# EAGLE design IA-prop (EAGLE 6.1)
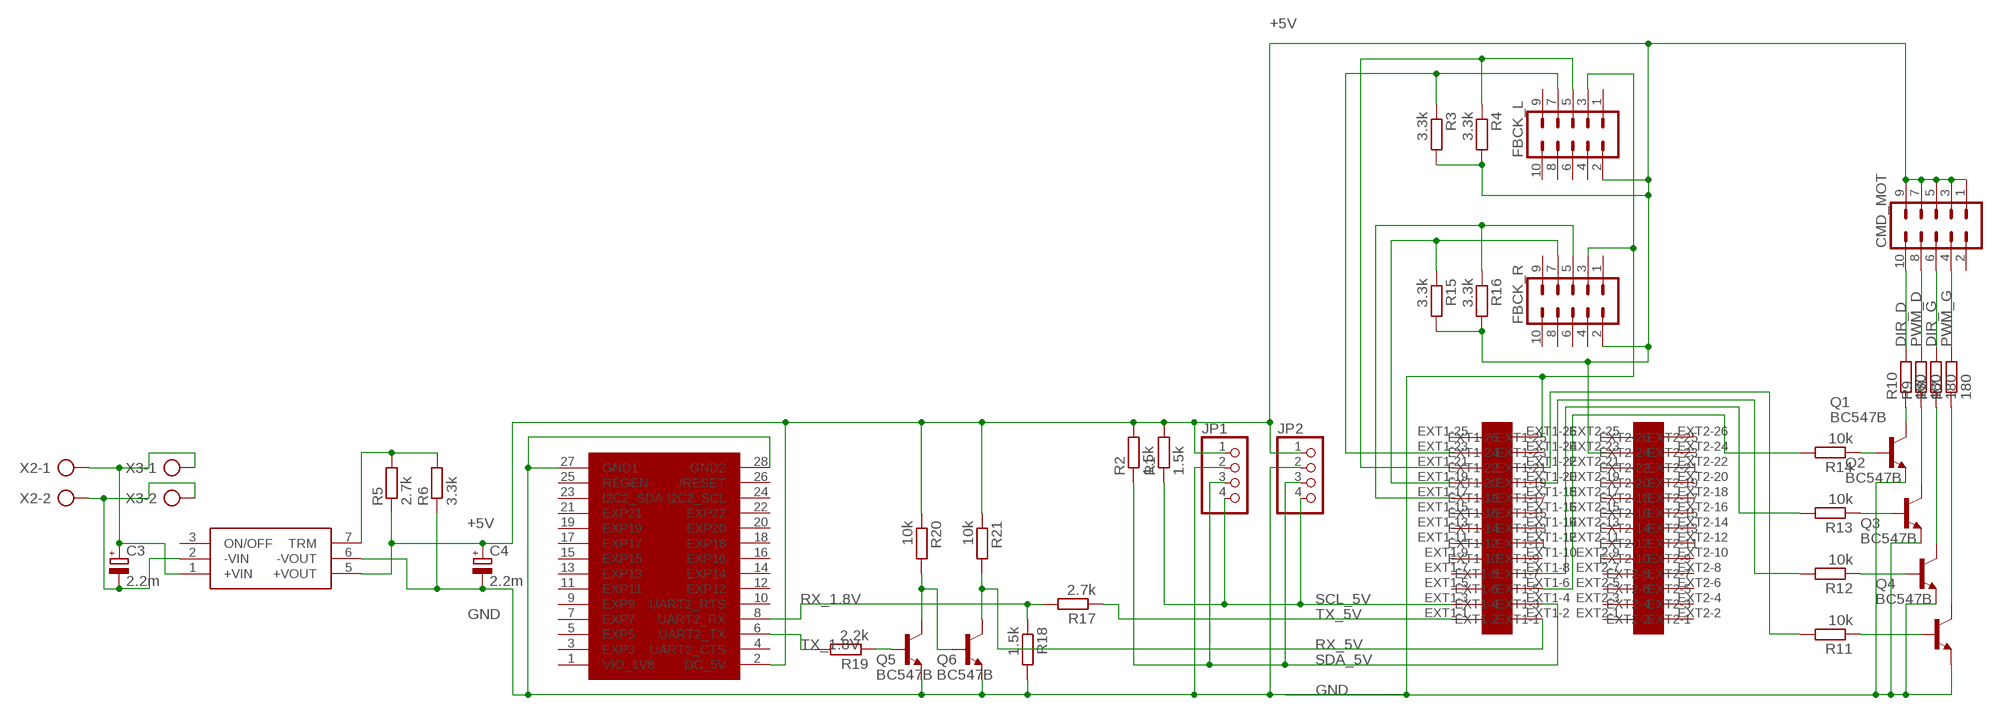
[diagram p0: schematic, sheet 1]

## Parts
BB1  BEAGLEBOARD  [BEAGLEBOARD]
C3  2.2m  CPOL-EUE5-13  [E5-13]
C4  2.2m  CPOL-EUE5-13  [E5-13]
CMD_MOT  MA05-2  [MA05-2]
FBCK_L  MA05-2  [MA05-2]
FBCK_R  MA05-2  [MA05-2]
JP1  PINHD-1X4  [1X04]
JP2  PINHD-1X4  [1X04]
Q1  BC547B  [TO92]
Q2  BC547B  [TO92]
Q3  BC547B  [TO92]
Q4  BC547B  [TO92]
Q5  BC547B  [TO92]
Q6  BC547B  [TO92]
R1  1.5k  R-EU_0207/12  [0207/12]
R2  1.5k  R-EU_0207/7  [0207/7]
R3  3.3k  R-EU_0207/7  [0207/7]
R4  3.3k  R-EU_0207/7  [0207/7]
R5  2.7k  R-EU_0207/7  [0207/7]
R6  3.3k  R-EU_0207/7  [0207/7]
R7  180  R-EU_0207/7  [0207/7]
R8  180  R-EU_0207/7  [0207/7]
R9  180  R-EU_0207/7  [0207/7]
R10  180  R-EU_0207/7  [0207/7]
R11  10k  R-EU_0207/10  [0207/10]
R12  10k  R-EU_0207/10  [0207/10]
R13  10k  R-EU_0207/7  [0207/7]
R14  10k  R-EU_0207/7  [0207/7]
R15  3.3k  R-EU_0207/7  [0207/7]
R16  3.3k  R-EU_0207/7  [0207/7]
R17  2.7k  R-EU_0207/10  [0207/10]
R18  1.5k  R-EU_0207/7  [0207/7]
R19  2.2k  R-EU_0207/7  [0207/7]
R20  10k  R-EU_0207/7  [0207/7]
R21  10k  R-EU_0207/7  [0207/7]
U$1  LPC-H2148LPC-H2148  [LPC-H2148]
U$2  TEN25-1211TEN25-1211  [TEN25]
X2  AK300/2  [AK300/2]
X3  AK300/2  [AK300/2]

## Nets
+5V: BB1.2(DC_5V) C4.+ CMD_MOT.1 CMD_MOT.3 CMD_MOT.5 CMD_MOT.7 CMD_MOT.9 FBCK_L.2 FBCK_R.2 JP1.1 JP2.1 R1.2 R2.2 R3.2 R4.2 R5.1 R15.2 R16.2 R20.1 R21.1 U$1.EXT2-23 U$2.5(+VOUT)
+12V: C3.+ U$2.1(+VIN) X2.1 X3.1
DIR_D: CMD_MOT.10 R10.2
DIR_G: CMD_MOT.6 R8.2
GND: BB1.27(GND1) BB1.28(GND2) C4.- FBCK_L.3 FBCK_R.3 JP1.2 JP2.2 Q1.1(E) Q2.1(E) Q3.1(E) Q4.1(E) Q5.1(E) Q6.1(E) R6.1 R18.2 U$1.EXT1-26 U$2.6(-VOUT)
GND_12: C3.- U$2.2(-VIN) X2.2 X3.2
N$1: R5.2 R6.2 U$2.7(TRM)
N$5: R13.2 U$1.EXT1-8
N$6: R12.2 U$1.EXT1-20
N$7: FBCK_L.7 R3.1 U$1.EXT1-23
N$8: R11.2 U$1.EXT1-22
N$9: Q5.2(B) R19.1
N$11: Q5.3(C) Q6.2(B) R20.2
N$18: FBCK_R.7 R15.1 U$1.EXT1-19
N$19: Q1.3(C) R10.1
N$20: Q2.3(C) R9.1
N$21: Q3.3(C) R8.1
N$22: Q4.3(C) R7.1
N$23: Q1.2(B) R14.1
N$24: Q2.2(B) R13.1
N$25: Q3.2(B) R12.1
N$26: Q4.2(B) R11.1
N$27: R14.2 U$1.EXT1-6
N$32: FBCK_R.5 R16.1 U$1.EXT1-17
N$33: FBCK_L.5 R4.1 U$1.EXT1-21
PWM_D: CMD_MOT.8 R9.2
PWM_G: CMD_MOT.4 R7.2
RX_1.8V: BB1.8(UART2_RX) R17.2 R18.1
RX_5V: Q6.3(C) R21.2 U$1.EXT1-2
SCL_5V: JP1.4 JP2.4 R1.1 U$1.EXT1-3
SDA_5V: JP1.3 JP2.3 R2.1 U$1.EXT1-4
TX_1.8V: BB1.6(UART2_TX) R19.2
TX_5V: R17.1 U$1.EXT1-1
Unconnected: BB1.1(VIO_1V8) BB1.3(EXP3) BB1.4(UART2_CTS) BB1.5(EXP5) BB1.7(EXP7) BB1.9(EXP9) BB1.10(UART2_RTS) BB1.11(EXP11) BB1.12(EXP12) BB1.13(EXP13) BB1.14(EXP14) BB1.15(EXP15) BB1.16(EXP16) BB1.17(EXP17) BB1.18(EXP18) BB1.19(EXP19) BB1.20(EXP20) BB1.21(EXP21) BB1.22(EXP22) BB1.23(I2C2_SDA) BB1.24(I2C2_SCL) BB1.25(REGEN) BB1.26(/RESET) CMD_MOT.2 FBCK_L.1 FBCK_L.4 FBCK_L.6 FBCK_L.8 FBCK_L.9 FBCK_L.10 FBCK_R.1 FBCK_R.4 FBCK_R.6 FBCK_R.8 FBCK_R.9 FBCK_R.10 U$1.EXT1-5 U$1.EXT1-7 U$1.EXT1-9 U$1.EXT1-10 U$1.EXT1-11 U$1.EXT1-12 U$1.EXT1-13 U$1.EXT1-14 U$1.EXT1-15 U$1.EXT1-16 U$1.EXT1-18 U$1.EXT1-24 U$1.EXT1-25 U$1.EXT2-1 U$1.EXT2-2 U$1.EXT2-3 U$1.EXT2-4 U$1.EXT2-5 U$1.EXT2-6 U$1.EXT2-7 U$1.EXT2-8 U$1.EXT2-9 U$1.EXT2-10 U$1.EXT2-11 U$1.EXT2-12 U$1.EXT2-13 U$1.EXT2-14 U$1.EXT2-15 U$1.EXT2-16 U$1.EXT2-17 U$1.EXT2-18 U$1.EXT2-19 U$1.EXT2-20 U$1.EXT2-21 U$1.EXT2-22 U$1.EXT2-24 U$1.EXT2-25 U$1.EXT2-26 U$2.3(ON/OFF)

## Library data of the parts
BB1 = beagleboard:BEAGLEBOARD
C3 C4 = resistor:CPOL-EU: POLARIZED CAPACITOR, European symbol
CMD_MOT FBCK_L FBCK_R = con-lstb:MA05-2: PIN HEADER; OC_FARNELL: unknown; OC_NEWARK: unknown
JP1 JP2 = pinhead:PINHD-1X4: PIN HEADER
Q1-Q6 = transistor-npn:BC547*: NPN Transistor
R1 R2 R5 R6 R17-R21 = resistor:R-EU_: RESISTOR, European symbol
R3 R4 R7-R16 = rcl:R-EU_: RESISTOR, European symbol
U$1 = LPC-H2148:LPC-H2148
U$2 = tracopower:TEN25-1211
X2 X3 = con-ptr500:AK300/2: CONNECTOR; OC_FARNELL: unknown; OC_NEWARK: unknown

## Board
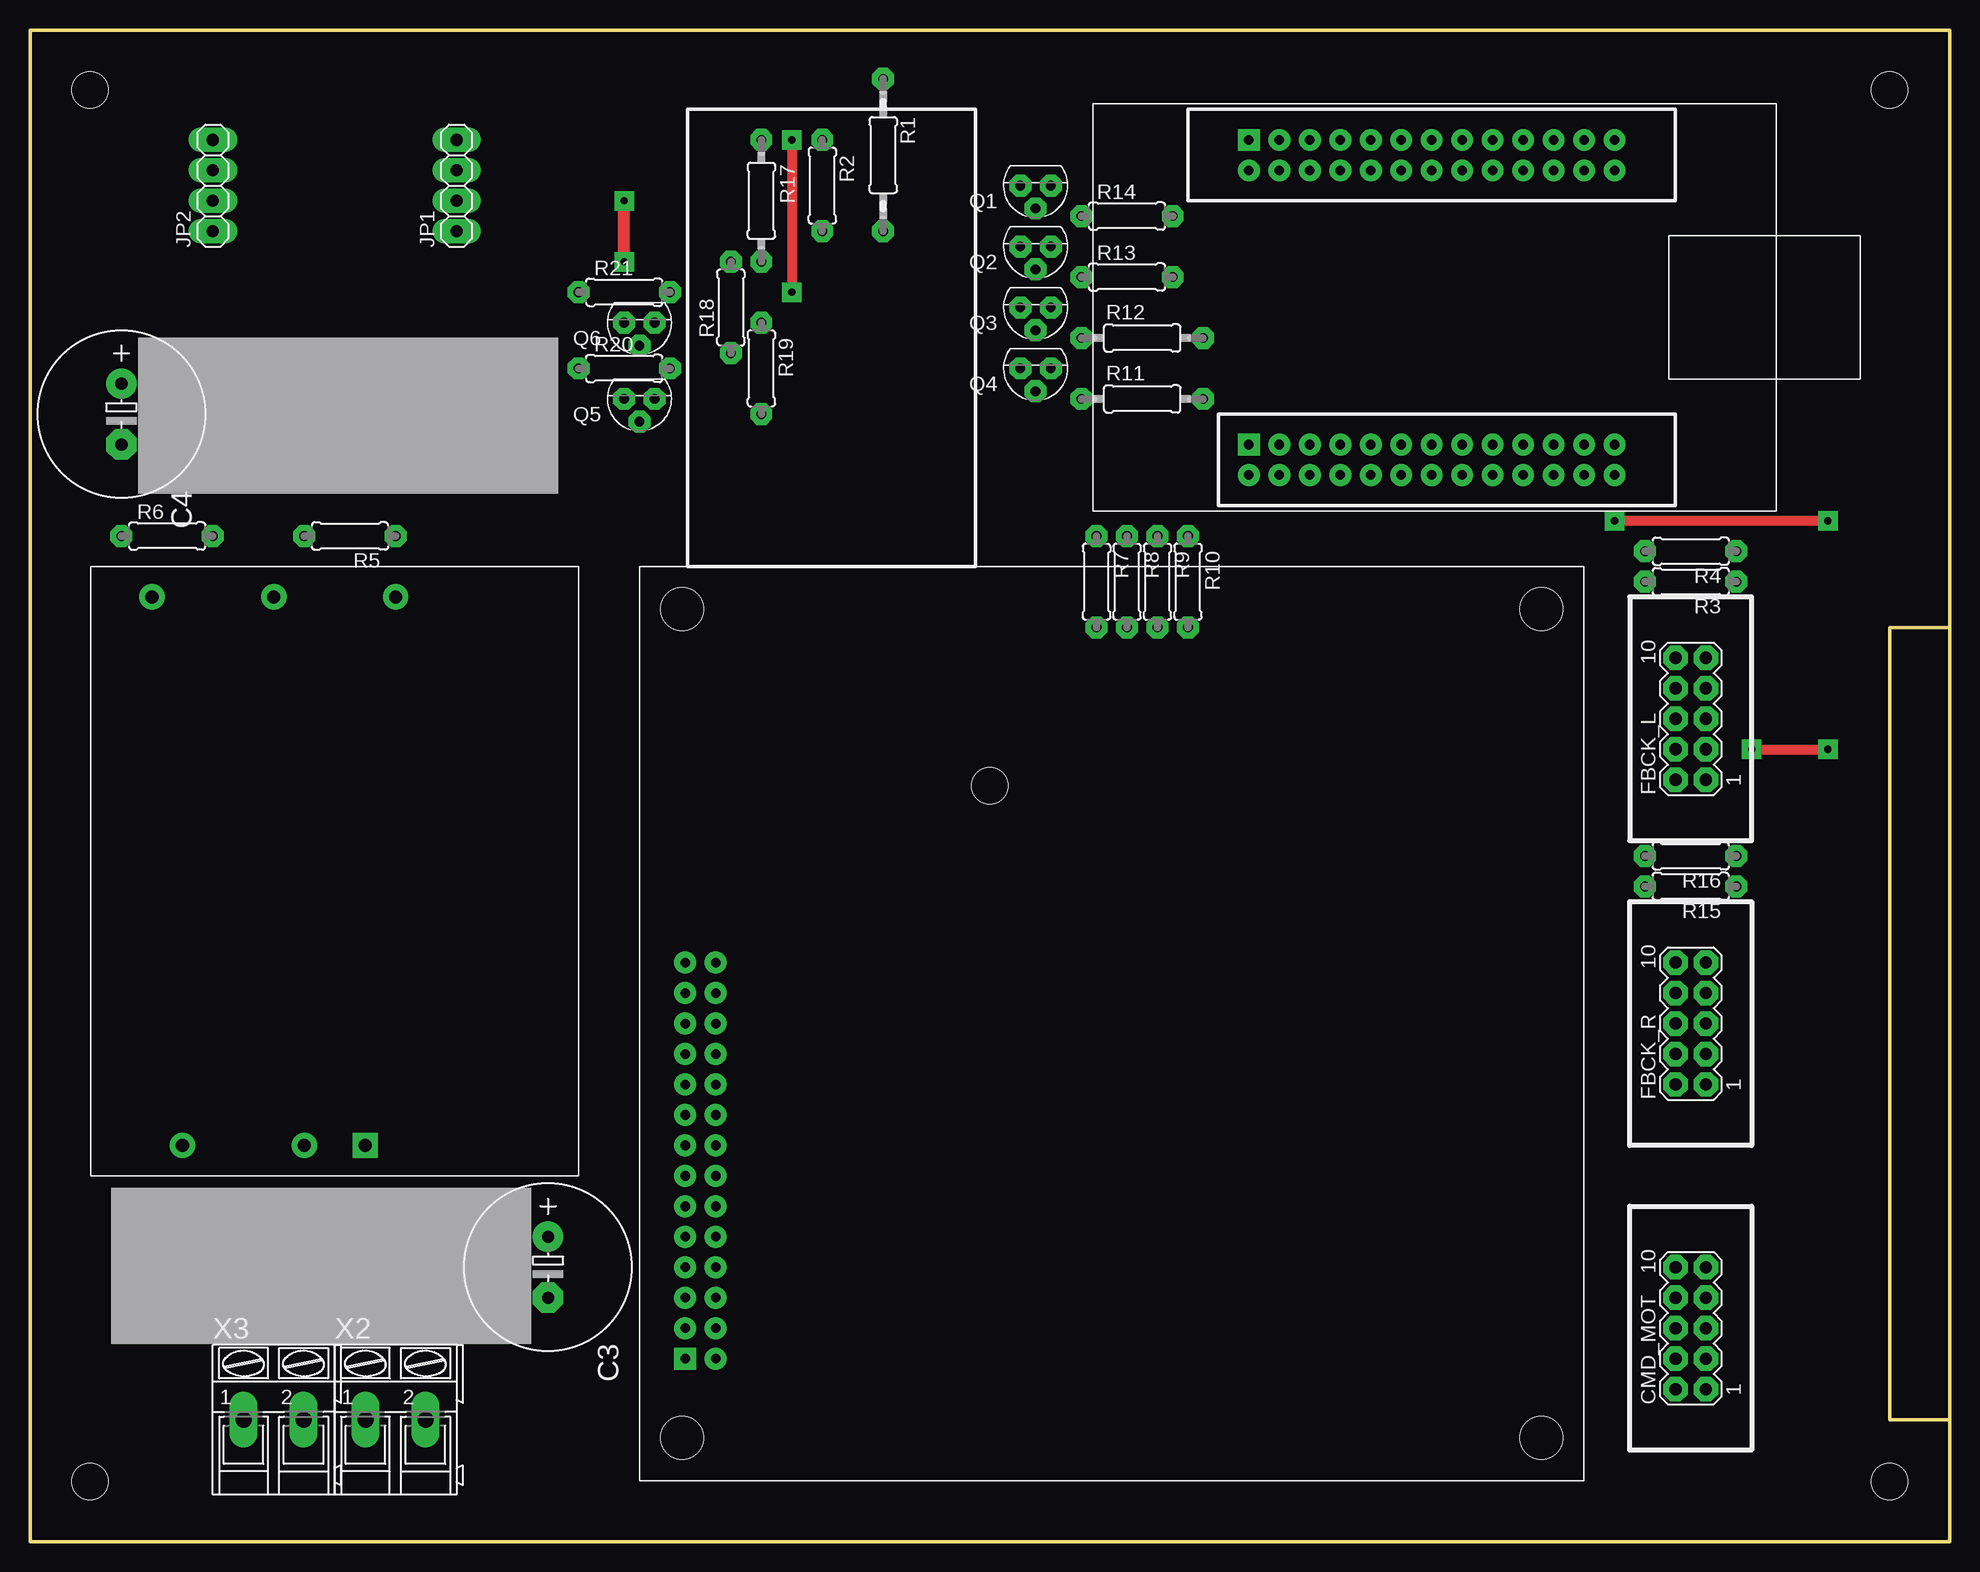
[diagram p1: board, top side]
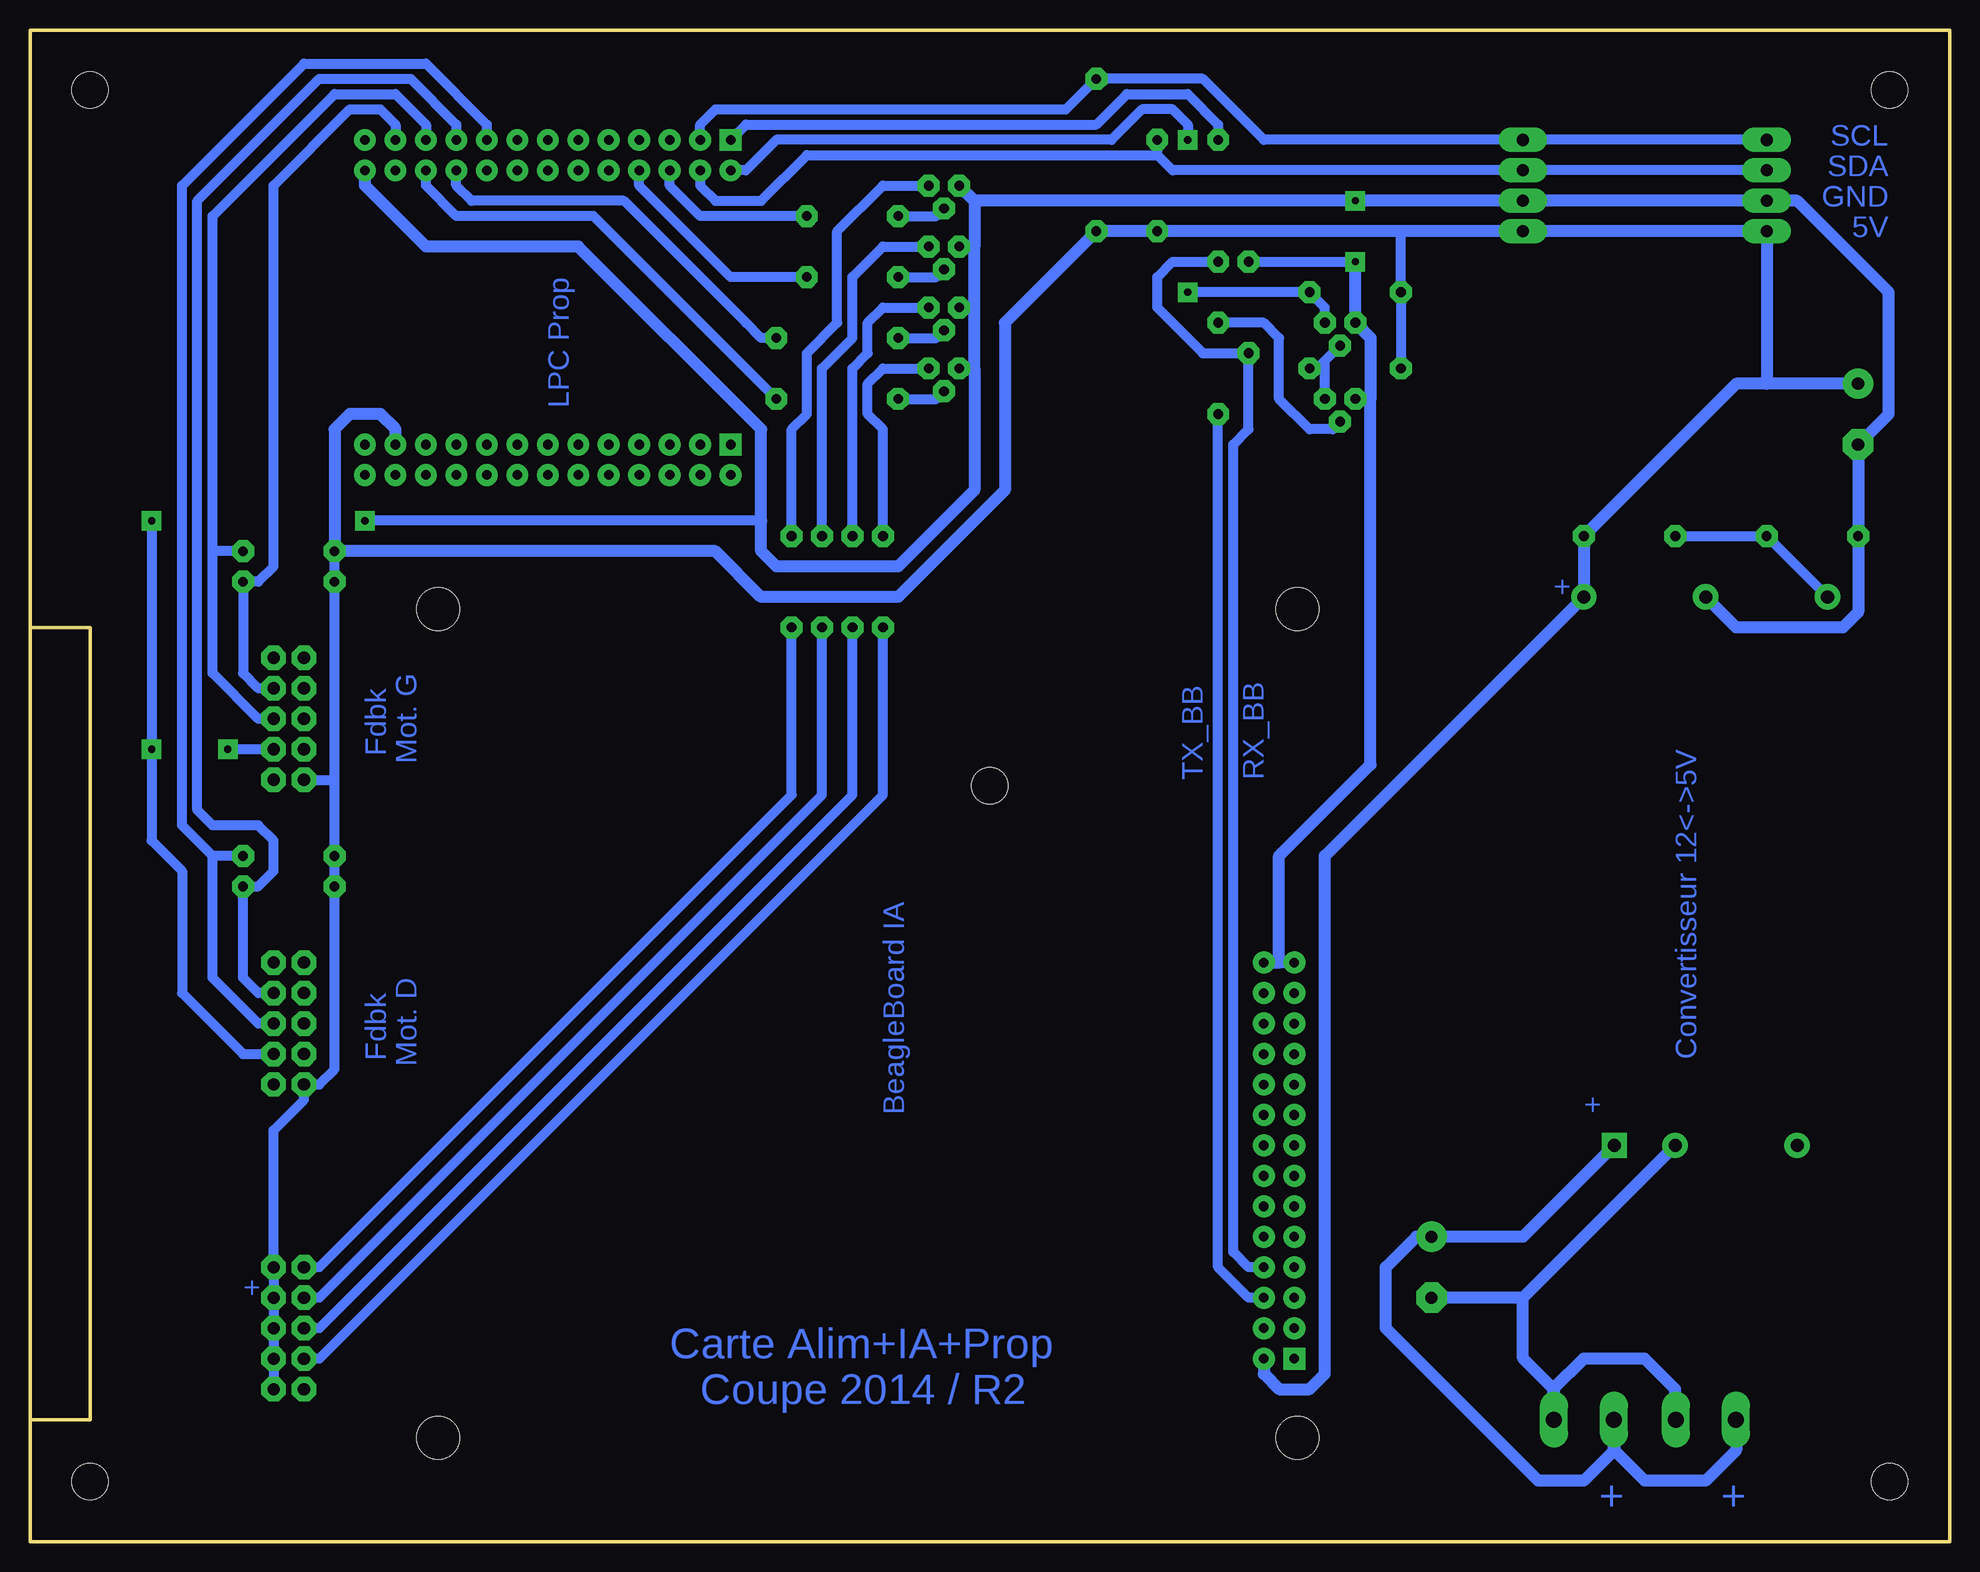
[diagram p2: board, bottom side, seen from below]

Size 160 x 126 mm. Coordinates in mm from the lower left corner, seen from the top.
Outline: 160,10.16 160,0 0,0 0,126 160,126 160,76.2
Outline: 160,10.16 160,76.2
Outline: 160,76.2 155,76.2 155,10.16 160,10.16
Copper layers (1*16): Top 0.035mm / dielectric 1.5mm / Bottom 0.035mm
Design rules: minimum track width 10mil, minimum drill 10mil, track to track 15mil, track to pad 15mil, pad to pad 15mil, via to via 15mil, smd to smd 8mil, copper to edge 40mil, drill to drill 8mil, minimum pad ring 15mil, minimum via ring 8mil, stop-mask expansion 4mil, vias tented up to drill 0mil, thermal gap 10mil
Holes 3 mm at 5,121 155,121 155,5 5,5 80,63

### Footprints (pad centres in the part's own frame; a part is rotated, then mirrored left to right if it is on the bottom)
BEAGLEBOARD = drill 0.8 square: 1 3.81,10.16 | drill 0.8: 2 6.35,10.16; 3 3.81,12.7; 4 6.35,12.7; 5 3.81,15.24; 6 6.35,15.24; 7 3.81,17.78; 8 6.35,17.78; 9 3.81,20.32; 10 6.35,20.32; 11 3.81,22.86; 12 6.35,22.86; 13 3.81,25.4; 14 6.35,25.4; 15 3.81,27.94; 16 6.35,27.94; 17 3.81,30.48; 18 6.35,30.48; 19 3.81,33.02; 20 6.35,33.02; 21 3.81,35.56; 22 6.35,35.56; 23 3.81,38.1; 24 6.35,38.1; 25 3.81,40.64; 26 6.35,40.64; 27 3.81,43.18; 28 6.35,43.18 | hole 3.556: 3.556,3.556; 3.556,72.644; 75.184,72.644; 75.184,3.556
E5-13 = drill 1.016 pad 2.54: + -2.54,0 | drill 1.016 pad 2.54 octagon: - 2.54,0
MA05-2 = drill 1.016 octagon: 1 -5.08,-1.27; 2 -5.08,1.27; 3 -2.54,-1.27; 4 -2.54,1.27; 5 0,-1.27; 6 0,1.27; 7 2.54,-1.27; 8 2.54,1.27; 9 5.08,-1.27; 10 5.08,1.27
1X04 = drill 1.016 long: 1 -3.81,0; 2 -1.27,0; 3 1.27,0; 4 3.81,0
TO92 = drill 0.813 octagon: 1 1.27,0; 2 0,1.905; 3 -1.27,0
0207/12 = drill 0.813 octagon: 1 -6.35,0; 2 6.35,0
0207/7 = drill 0.813 octagon: 1 -3.81,0; 2 3.81,0
0207/10 = drill 0.813 octagon: 1 -5.08,0; 2 5.08,0
LPC-H2148 = drill 0.8 square: EXT1-1 0,0; EXT2-1 25.4,0 | drill 0.8: EXT1-2 2.54,0; EXT1-3 0,2.54; EXT1-4 2.54,2.54; EXT1-5 0,5.08; EXT1-6 2.54,5.08; EXT1-7 0,7.62; EXT1-8 2.54,7.62; EXT1-9 0,10.16; EXT1-10 2.54,10.16; EXT1-11 0,12.7; EXT1-12 2.54,12.7; EXT1-13 0,15.24; EXT1-14 2.54,15.24; EXT1-15 0,17.78; EXT1-16 2.54,17.78; EXT1-17 0,20.32; EXT1-18 2.54,20.32; EXT1-19 0,22.86; EXT1-20 2.54,22.86; EXT1-21 0,25.4; EXT1-22 2.54,25.4; EXT1-23 0,27.94; EXT1-24 2.54,27.94; EXT1-25 0,30.48; EXT1-26 2.54,30.48; EXT2-2 27.94,0; EXT2-3 25.4,2.54; EXT2-4 27.94,2.54; EXT2-5 25.4,5.08; EXT2-6 27.94,5.08; EXT2-7 25.4,7.62; EXT2-8 27.94,7.62; EXT2-9 25.4,10.16; EXT2-10 27.94,10.16; EXT2-11 25.4,12.7; EXT2-12 27.94,12.7; EXT2-13 25.4,15.24; EXT2-14 27.94,15.24; EXT2-15 25.4,17.78; EXT2-16 27.94,17.78; EXT2-17 25.4,20.32; EXT2-18 27.94,20.32; EXT2-19 25.4,22.86; EXT2-20 27.94,22.86; EXT2-21 25.4,25.4; EXT2-22 27.94,25.4; EXT2-23 25.4,27.94; EXT2-24 27.94,27.94; EXT2-25 25.4,30.48; EXT2-26 27.94,30.48
TEN25 = drill 1.1 pad 1.778 square: 1 0,0 | drill 1.1 pad 1.778: 2 0,5.08; 3 0,15.24; 5 45.72,-2.54; 6 45.72,7.62; 7 45.72,17.78
AK300/2 = drill 1.321 long: 1 -2.515,0; 2 2.489,0

### Placement (x,y rotation side)
BB1  50.8,5.08 0 top
C3  43.18,22.86 270 top
C4  7.62,93.98 270 top
CMD_MOT  138.43,17.78 90 top
FBCK_L  138.43,68.58 90 top
FBCK_R  138.43,43.18 90 top
JP1  35.56,113.03 90 top
JP2  15.24,113.03 90 top
Q1  83.82,113.03 180 top
Q2  83.82,107.95 180 top
Q3  83.82,102.87 180 top
Q4  83.82,97.79 180 top
Q5  50.8,95.25 180 top
Q6  50.8,101.6 180 top
R1  71.12,115.57 270 top
R2  66.04,113.03 270 top
R3  138.43,80.01 180 top
R4  138.43,82.55 180 top
R5  26.67,83.82 180 top
R6  11.43,83.82 0 top
R7  88.9,80.01 270 top
R8  91.44,80.01 270 top
R9  93.98,80.01 270 top
R10  96.52,80.01 270 top
R11  92.71,95.25 0 top
R12  92.71,100.33 0 top
R13  91.44,105.41 0 top
R14  91.44,110.49 0 top
R15  138.43,54.61 180 top
R16  138.43,57.15 180 top
R17  60.96,111.76 270 top
R18  58.42,102.87 90 top
R19  60.96,97.79 270 top
R20  49.53,97.79 0 top
R21  49.53,104.14 0 top
U$1  101.6,116.84 270 top
U$2  27.94,33.02 90 top
X2  30.48,10.16 0 top
X3  20.32,10.16 0 top

### Tracks (layer width: path | path; a pad name or v marks a point on that pad's centre or on a via)
+5V
  Bottom 0.813: CMD_MOT.1 CMD_MOT.3 CMD_MOT.5 CMD_MOT.7 CMD_MOT.9 139.7,34.29 137.16,36.83 FBCK_R.2 135.89,38.1 134.62,39.37 R15.2 R16.2 134.62,63.5 | 134.62,63.5 134.62,73.66 R3.2 R4.2 | FBCK_L.2 134.62,63.5 | R20.1 R21.1 45.72,109.22
  Bottom 1.016: C4.+ 15.24,96.52 | 15.24,96.52 17.78,96.52 R5.1 U$2.5 52.07,57.15 52.07,13.97 53.34,12.7 55.88,12.7 57.15,13.97 BB1.2 | U$1.EXT2-23 129.54,92.71 130.81,93.98 133.35,93.98 134.62,92.71 R4.2 102.87,82.55 99.06,78.74 87.63,78.74 78.74,87.63 78.74,101.6 R1.2 R2.2 45.72,109.22 JP1.1 JP2.1 15.24,96.52
+12V
  Bottom 1.016: U$2.1 35.56,25.4 C3.+ 44.45,25.4 46.99,22.86 46.99,17.78 34.29,5.08 30.48,5.08 27.94,7.62 | X3.1 17.78,10.13 17.78,7.62 20.32,5.08 25.4,5.08 27.94,7.62 | 27.94,7.62 27.96,7.64 X2.1 27.94,10.13 27.94,7.62
DIR_D
  Bottom 0.813: CMD_MOT.10 135.89,22.86 96.52,62.23 R10.2
DIR_G
  Bottom 0.813: CMD_MOT.6 135.89,17.78 91.44,62.23 R8.2
GND  (via drill 0.6)
  Top 0.813: v132.08,85.09 v149.86,85.09 | v143.51,66.04 v149.86,66.04
  Top 1.016: v49.53,106.68 v49.53,111.76
  Bottom 0.813: 48.26,95.25 Q5.1 | R18.2 v49.53,106.68 | 99.06,85.09 v132.08,85.09 | v149.86,85.09 v149.86,66.04 149.86,58.42 147.32,55.88 147.32,45.72 142.24,40.64 FBCK_R.3 | FBCK_L.3 v143.51,66.04
  Bottom 1.016: U$2.6 17.78,76.2 8.89,76.2 7.62,77.47 R6.1 C4.- 5.08,93.98 5.08,104.14 12.7,111.76 JP2.2 JP1.2 v49.53,111.76 81.28,111.76 | Q1.1 81.28,111.76 | 81.28,111.76 81.28,107.95 | 81.28,107.95 Q2.1 | Q3.1 81.28,102.87 | 81.28,102.87 81.28,107.95 | Q4.1 81.28,97.79 | 81.28,97.79 81.28,102.87 | 81.28,97.79 81.28,87.63 87.63,81.28 97.79,81.28 99.06,82.55 99.06,85.09 99.06,92.71 114.3,107.95 127,107.95 132.08,113.03 U$1.EXT1-26 | v49.53,106.68 Q6.1 48.26,100.33 48.26,95.25 48.26,64.77 55.88,57.15 55.88,48.26 | BB1.27 55.88,48.26 | BB1.28 55.88,48.26
GND_12
  Bottom 1.016: U$2.2 35.56,20.32 | 35.56,20.32 C3.- | 35.56,20.32 35.56,15.29 33.07,12.75 33.02,12.7 X2.2 32.97,12.75 30.48,15.24 25.4,15.24 22.86,12.7 22.86,10.21 X3.2
N$1
  Bottom 0.813: R5.2 R6.2 U$2.7
N$5
  Bottom 0.813: R13.2 101.6,105.41 109.22,113.03 U$1.EXT1-8
N$6
  Bottom 0.813: R12.2 99.06,100.33 100.33,101.6 110.49,111.76 123.19,111.76 124.46,113.03 U$1.EXT1-20
N$7
  Bottom 0.813: FBCK_L.7 140.97,71.12 142.24,72.39 R3.1 140.97,80.01 139.7,81.28 139.7,113.03 133.35,119.38 130.81,119.38 129.54,118.11 U$1.EXT1-23
N$8
  Bottom 0.813: R11.2 113.03,110.49 124.46,110.49 127,113.03 U$1.EXT1-22
N$9
  Bottom 0.813: Q5.2 51.44,92.71 53.34,92.71 55.88,95.25 55.88,100.33 57.15,101.6 R19.1
N$11
  Bottom 0.813: R20.2 52.7,97.79 52.07,98.42 | 52.07,98.42 Q6.2 | Q5.3 52.07,98.42
N$18
  Bottom 0.813: FBCK_R.7 140.97,45.72 142.24,46.99 R15.1 140.97,54.61 139.7,55.88 139.7,58.42 140.97,59.69 144.78,59.69 146.05,60.96 146.05,111.76 135.89,121.92 128.27,121.92 124.46,118.11 U$1.EXT1-19
N$19
  Bottom 0.813: R10.1 96.52,92.71 95.25,93.98 95.25,99.06 92.71,101.6 92.71,109.22 88.9,113.03 Q1.3
N$20
  Bottom 0.813: R9.1 93.98,97.79 91.44,100.33 91.44,105.41 88.9,107.95 Q2.3
N$21
  Bottom 0.813: R8.1 91.44,97.79 90.17,99.06 90.17,101.6 88.9,102.87 Q3.3
N$22
  Bottom 0.813: R7.1 88.9,92.71 90.17,93.98 90.17,96.52 88.9,97.79 Q4.3
N$23
  Bottom 0.813: R14.1 84.45,110.49 Q1.2
N$24
  Bottom 0.813: R13.1 84.45,105.41 Q2.2
N$25
  Bottom 0.813: R12.1 84.45,100.33 Q3.2
N$26
  Bottom 0.813: R11.1 84.45,95.25 Q4.2
N$27
  Bottom 0.813: R14.2 104.14,110.49 106.68,113.03 U$1.EXT1-6
N$32
  Bottom 0.813: FBCK_R.5 140.97,43.18 144.78,46.99 144.78,57.15 | R16.1 144.78,57.15 | 144.78,57.15 147.32,59.69 147.32,113.03 137.16,123.19 127,123.19 121.92,118.11 U$1.EXT1-17
N$33
  Bottom 0.813: FBCK_L.5 140.97,68.58 144.78,72.39 144.78,82.55 | R4.1 144.78,82.55 | 144.78,82.55 144.78,110.49 134.62,120.65 129.54,120.65 127,118.11 U$1.EXT1-21
PWM_D
  Bottom 0.813: CMD_MOT.8 135.89,20.32 93.98,62.23 R9.2
PWM_G
  Bottom 0.813: CMD_MOT.4 135.89,15.24 88.9,62.23 R7.2
RX_1.8V
  Bottom 0.813: R17.2 64.77,106.68 66.04,105.41 66.04,102.87 62.23,99.06 R18.1 58.42,92.71 59.69,91.44 59.69,24.13 58.42,22.86 BB1.8
RX_5V  (via drill 0.6)
  Top 0.813: v63.5,116.84 v63.5,104.14
  Bottom 0.813: U$1.EXT1-2 100.33,114.3 97.79,116.84 69.85,116.84 67.31,119.38 64.77,119.38 63.5,118.11 v63.5,116.84 | Q6.3 52.07,102.87 R21.2 v63.5,104.14
SCL_5V
  Bottom 0.813: JP2.4 JP1.4 57.15,116.84 62.23,121.92 R1.1 73.66,119.38 102.87,119.38 104.14,118.11 U$1.EXT1-3
SDA_5V
  Bottom 0.813: JP2.3 JP1.3 64.77,114.3 66.04,115.57 | 66.04,115.57 R2.1 | U$1.EXT1-4 104.14,113.03 102.87,111.76 99.06,111.76 95.25,115.57 66.04,115.57
TX_1.8V
  Bottom 0.813: BB1.6 58.42,20.32 60.96,22.86 R19.2
TX_5V
  Bottom 0.813: U$1.EXT1-1 100.33,118.11 71.12,118.11 68.58,120.65 63.5,120.65 60.96,118.11 R17.1

### Text on the board
Bottom: SCL | SDA | GND | 5V | LPC Prop | + | Mot. G | Fdbk | Convertisseur 12<->5V | RX_BB | TX_BB | BeagleBoard IA | Mot. D | Fdbk | + | + | Carte Alim+IA+Prop | Coupe 2014 / R2 | + | +
bDocu: LCST